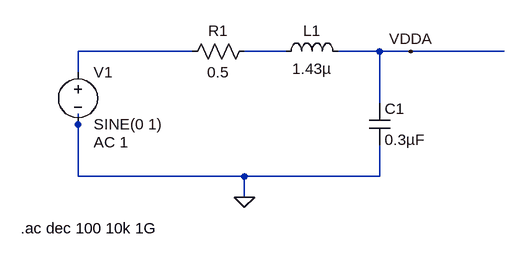
[diagram p0: schematic FerriteBead.asc]
FerriteBead.asc, the LTspice schematic file:
Version 4.1
SHEET 1 880 680
WIRE 16 64 -160 64
WIRE 160 64 96 64
WIRE 304 64 240 64
WIRE 352 64 304 64
WIRE 496 64 352 64
WIRE -160 96 -160 64
WIRE 304 144 304 64
WIRE -160 176 -160 160
WIRE -160 256 -160 176
WIRE 96 256 -160 256
WIRE 304 256 304 208
WIRE 304 256 96 256
WIRE 96 288 96 256
FLAG 96 288 0
FLAG 352 64 VDDA
SYMBOL voltage -160 80 R0
WINDOW 123 24 124 Left 2
WINDOW 39 0 0 Left 0
SYMATTR Value2 AC 1
SYMATTR InstName V1
SYMATTR Value SINE(0 1)
SYMBOL res 0 80 R270
WINDOW 0 32 56 VTop 2
WINDOW 3 0 56 VBottom 2
SYMATTR InstName R1
SYMATTR Value 0.5
SYMBOL ind 144 80 R270
WINDOW 0 32 56 VTop 2
WINDOW 3 5 56 VBottom 2
SYMATTR InstName L1
SYMATTR Value 1.43µ
SYMATTR SpiceLine Rser=1m
SYMBOL cap 288 144 R0
SYMATTR InstName C1
SYMATTR Value 0.3µF
TEXT -248 336 Left 2 !.ac dec 100 10k 1G

The netlist it stands for:
* FerriteBead.asc
V1 N001 0 SINE(0 1) AC 1
R1 N001 N002 0.5
L1 N002 VDDA 1.43µ Rser=1m
C1 VDDA 0 0.3µF
.ac dec 100 10k 1G
.backanno
.end